# Altium schematic sheet MB1076.SchDoc
size A4; SheetNumber: 1; SheetTotal: 5
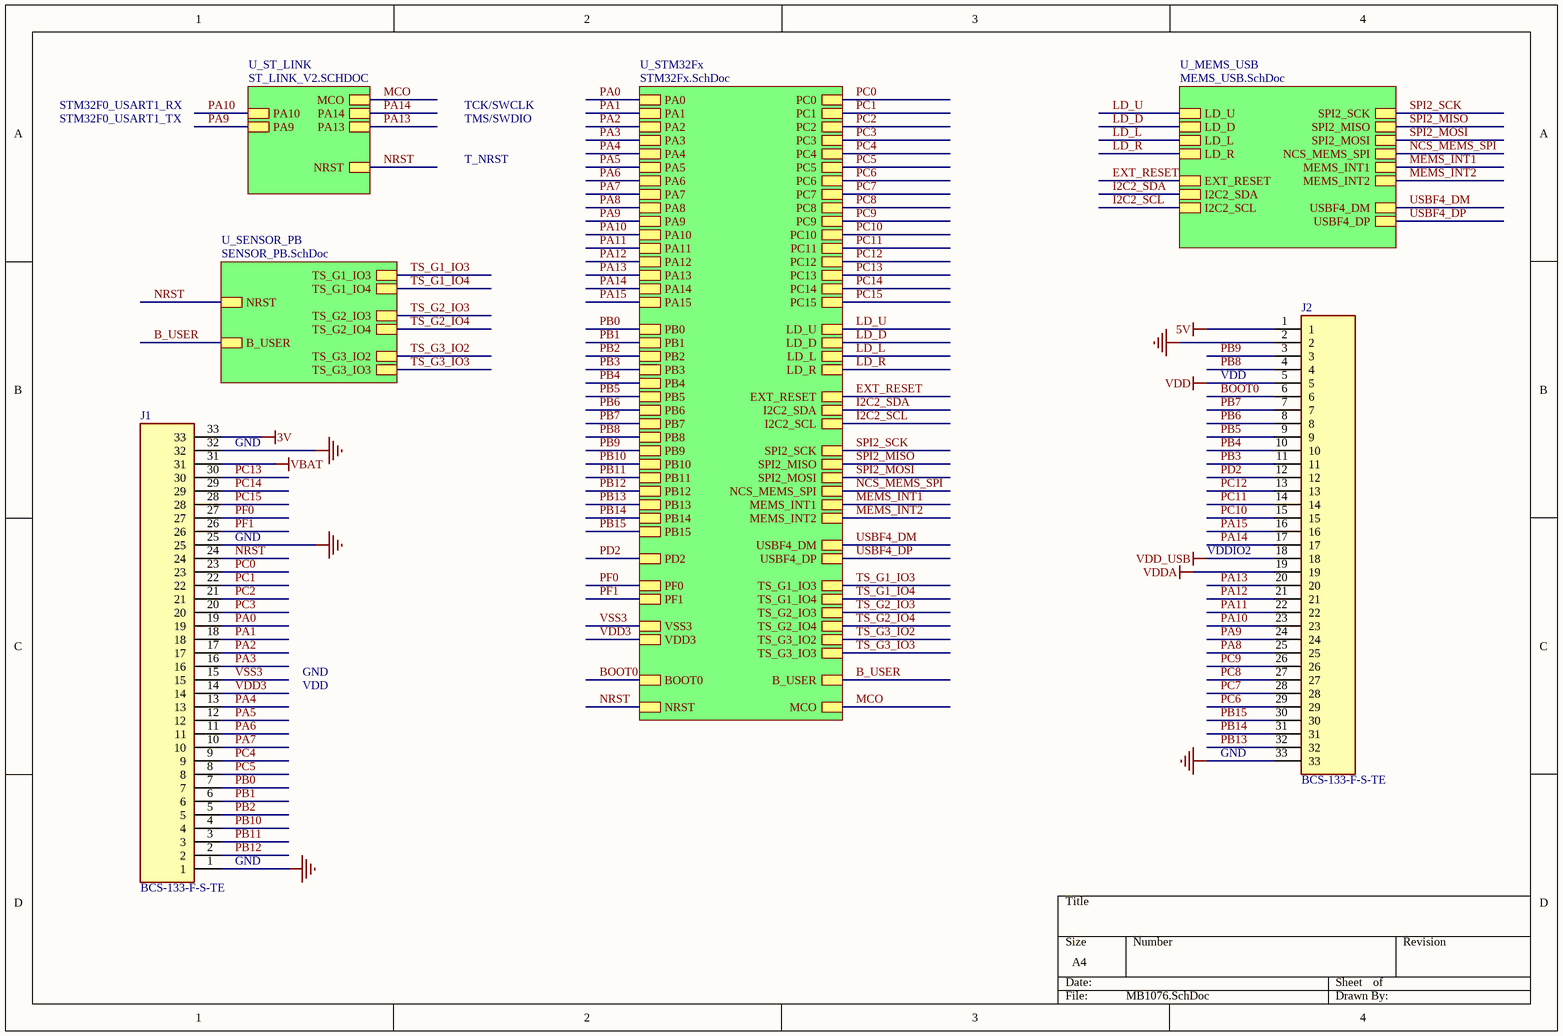
[diagram p0: MB1076.SchDoc]

## Parts
J1  BCS-133-F-S-TE  [BCS-133-XXX-S-TE]
J2  BCS-133-F-S-TE  [BCS-133-XXX-S-TE]

## Sub-sheets
U_MEMS_USB = MEMS_USB.SchDoc: LD_D, LD_U, LD_L, LD_R, EXT_RESET, MEMS_INT1, NCS_MEMS_SPI, MEMS_INT2, SPI2_SCK, SPI2_MISO, SPI2_MOSI, USBF4_DM, USBF4_DP, I2C2_SCL, I2C2_SDA
U_SENSOR_PB = SENSOR_PB.SchDoc: NRST, TS_G1_IO3, TS_G1_IO4, TS_G2_IO3, TS_G2_IO4, TS_G3_IO2, TS_G3_IO3, B_USER
U_ST_LINK = ST_LINK_V2.SCHDOC: PA13, PA14, NRST, MCO, PA10, PA9
U_STM32Fx = STM32Fx.SchDoc: PB8, PC5, PC4, PD2, BOOT0, NRST, PC15, PC14, PF1, PF0, MCO, VSS3, PC0, PC1, PC2, PC3, PC6, PC7, PC8, PC9, PC10, PC11, PC12, PC13, PA0, PA1, PA2, PA3, PA4, PA5, PA6, PA7, PA8, PA9, PA10, PA11, PA12, PA13, PA14, PA15, PB0, PB1, PB2, PB3, PB4, PB5, PB6, PB7, PB9, PB10, PB11, PB12, PB13, PB14, PB15, EXT_RESET, I2C2_SCL, I2C2_SDA, TS_G1_IO3, TS_G1_IO4, TS_G2_IO3, TS_G2_IO4, TS_G3_IO2, TS_G3_IO3, VDD3, B_USER, USBF4_DM, USBF4_DP, LD_D, LD_U, LD_L, LD_R, SPI2_SCK, SPI2_MISO, SPI2_MOSI, MEMS_INT1, NCS_MEMS_SPI, MEMS_INT2

## Nets
3V: J1.33
5V: J2.1
GND: J1.1 J1.25 J1.32 J2.2 J2.33
VBAT: J1.31
VDD: J2.5
VDD_USB: J2.18
VDDA: J2.19
B_USER: sheet U_STM32Fx/B_USER, sheet U_SENSOR_PB/B_USER
BOOT0: J2.6 ; sheet U_STM32Fx/BOOT0
EXT_RESET: sheet U_MEMS_USB/EXT_RESET, sheet U_STM32Fx/EXT_RESET
I2C2_SCL: sheet U_MEMS_USB/I2C2_SCL, sheet U_STM32Fx/I2C2_SCL
I2C2_SDA: sheet U_MEMS_USB/I2C2_SDA, sheet U_STM32Fx/I2C2_SDA
LD_D: sheet U_MEMS_USB/LD_D, sheet U_STM32Fx/LD_D
LD_L: sheet U_MEMS_USB/LD_L, sheet U_STM32Fx/LD_L
LD_R: sheet U_MEMS_USB/LD_R, sheet U_STM32Fx/LD_R
LD_U: sheet U_MEMS_USB/LD_U, sheet U_STM32Fx/LD_U
MCO: sheet U_ST_LINK/MCO, sheet U_STM32Fx/MCO
MEMS_INT1: sheet U_MEMS_USB/MEMS_INT1, sheet U_STM32Fx/MEMS_INT1
MEMS_INT2: sheet U_MEMS_USB/MEMS_INT2, sheet U_STM32Fx/MEMS_INT2
NCS_MEMS_SPI: sheet U_MEMS_USB/NCS_MEMS_SPI, sheet U_STM32Fx/NCS_MEMS_SPI
NRST: J1.24 ; sheet U_ST_LINK/NRST, sheet U_STM32Fx/NRST, sheet U_SENSOR_PB/NRST
PA0: J1.19 ; sheet U_STM32Fx/PA0
PA1: J1.18 ; sheet U_STM32Fx/PA1
PA2: J1.17 ; sheet U_STM32Fx/PA2
PA3: J1.16 ; sheet U_STM32Fx/PA3
PA4: J1.13 ; sheet U_STM32Fx/PA4
PA5: J1.12 ; sheet U_STM32Fx/PA5
PA6: J1.11 ; sheet U_STM32Fx/PA6
PA7: J1.10 ; sheet U_STM32Fx/PA7
PA8: J2.25 ; sheet U_STM32Fx/PA8
PA9: J2.24 ; sheet U_ST_LINK/PA9, sheet U_STM32Fx/PA9
PA10: J2.23 ; sheet U_ST_LINK/PA10, sheet U_STM32Fx/PA10
PA11: J2.22 ; sheet U_STM32Fx/PA11
PA12: J2.21 ; sheet U_STM32Fx/PA12
PA13: J2.20 ; sheet U_ST_LINK/PA13, sheet U_STM32Fx/PA13
PA14: J2.17 ; sheet U_ST_LINK/PA14, sheet U_STM32Fx/PA14
PA15: J2.16 ; sheet U_STM32Fx/PA15
PB0: J1.7 ; sheet U_STM32Fx/PB0
PB1: J1.6 ; sheet U_STM32Fx/PB1
PB2: J1.5 ; sheet U_STM32Fx/PB2
PB3: J2.11 ; sheet U_STM32Fx/PB3
PB4: J2.10 ; sheet U_STM32Fx/PB4
PB5: J2.9 ; sheet U_STM32Fx/PB5
PB6: J2.8 ; sheet U_STM32Fx/PB6
PB7: J2.7 ; sheet U_STM32Fx/PB7
PB8: J2.4 ; sheet U_STM32Fx/PB8
PB9: J2.3 ; sheet U_STM32Fx/PB9
PB10: J1.4 ; sheet U_STM32Fx/PB10
PB11: J1.3 ; sheet U_STM32Fx/PB11
PB12: J1.2 ; sheet U_STM32Fx/PB12
PB13: J2.32 ; sheet U_STM32Fx/PB13
PB14: J2.31 ; sheet U_STM32Fx/PB14
PB15: J2.30 ; sheet U_STM32Fx/PB15
PC0: J1.23 ; sheet U_STM32Fx/PC0
PC1: J1.22 ; sheet U_STM32Fx/PC1
PC2: J1.21 ; sheet U_STM32Fx/PC2
PC3: J1.20 ; sheet U_STM32Fx/PC3
PC4: J1.9 ; sheet U_STM32Fx/PC4
PC5: J1.8 ; sheet U_STM32Fx/PC5
PC6: J2.29 ; sheet U_STM32Fx/PC6
PC7: J2.28 ; sheet U_STM32Fx/PC7
PC8: J2.27 ; sheet U_STM32Fx/PC8
PC9: J2.26 ; sheet U_STM32Fx/PC9
PC10: J2.15 ; sheet U_STM32Fx/PC10
PC11: J2.14 ; sheet U_STM32Fx/PC11
PC12: J2.13 ; sheet U_STM32Fx/PC12
PC13: J1.30 ; sheet U_STM32Fx/PC13
PC14: J1.29 ; sheet U_STM32Fx/PC14
PC15: J1.28 ; sheet U_STM32Fx/PC15
PD2: J2.12 ; sheet U_STM32Fx/PD2
PF0: J1.27 ; sheet U_STM32Fx/PF0
PF1: J1.26 ; sheet U_STM32Fx/PF1
SPI2_MISO: sheet U_MEMS_USB/SPI2_MISO, sheet U_STM32Fx/SPI2_MISO
SPI2_MOSI: sheet U_MEMS_USB/SPI2_MOSI, sheet U_STM32Fx/SPI2_MOSI
SPI2_SCK: sheet U_MEMS_USB/SPI2_SCK, sheet U_STM32Fx/SPI2_SCK
TS_G1_IO3: sheet U_STM32Fx/TS_G1_IO3, sheet U_SENSOR_PB/TS_G1_IO3
TS_G1_IO4: sheet U_STM32Fx/TS_G1_IO4, sheet U_SENSOR_PB/TS_G1_IO4
TS_G2_IO3: sheet U_STM32Fx/TS_G2_IO3, sheet U_SENSOR_PB/TS_G2_IO3
TS_G2_IO4: sheet U_STM32Fx/TS_G2_IO4, sheet U_SENSOR_PB/TS_G2_IO4
TS_G3_IO2: sheet U_STM32Fx/TS_G3_IO2, sheet U_SENSOR_PB/TS_G3_IO2
TS_G3_IO3: sheet U_STM32Fx/TS_G3_IO3, sheet U_SENSOR_PB/TS_G3_IO3
USBF4_DM: sheet U_MEMS_USB/USBF4_DM, sheet U_STM32Fx/USBF4_DM
USBF4_DP: sheet U_MEMS_USB/USBF4_DP, sheet U_STM32Fx/USBF4_DP
VDD3: J1.14 ; sheet U_STM32Fx/VDD3
VSS3: J1.15 ; sheet U_STM32Fx/VSS3

## Notes on the sheet
- STM32F0_USART1_RX
- TCK/SWCLK
- STM32F0_USART1_TX
- TMS/SWDIO
- T_NRST
- VDD
- (near J1) GND
- VDDIO2
- GND

## Library data of the parts
J1 J2 = BCS-133-F-S-TE: Connector; Manufacturer_Name: SAMTEC; Datasheet Link: http://suddendocs.samtec.com/prints/bcs-1xx-xxx-x-xx-xxx-mkt.pdf; Manufacturer_Part_Number: BCS-133-F-S-TE